# Altium project AC6901Demo_Project.PrjPcb
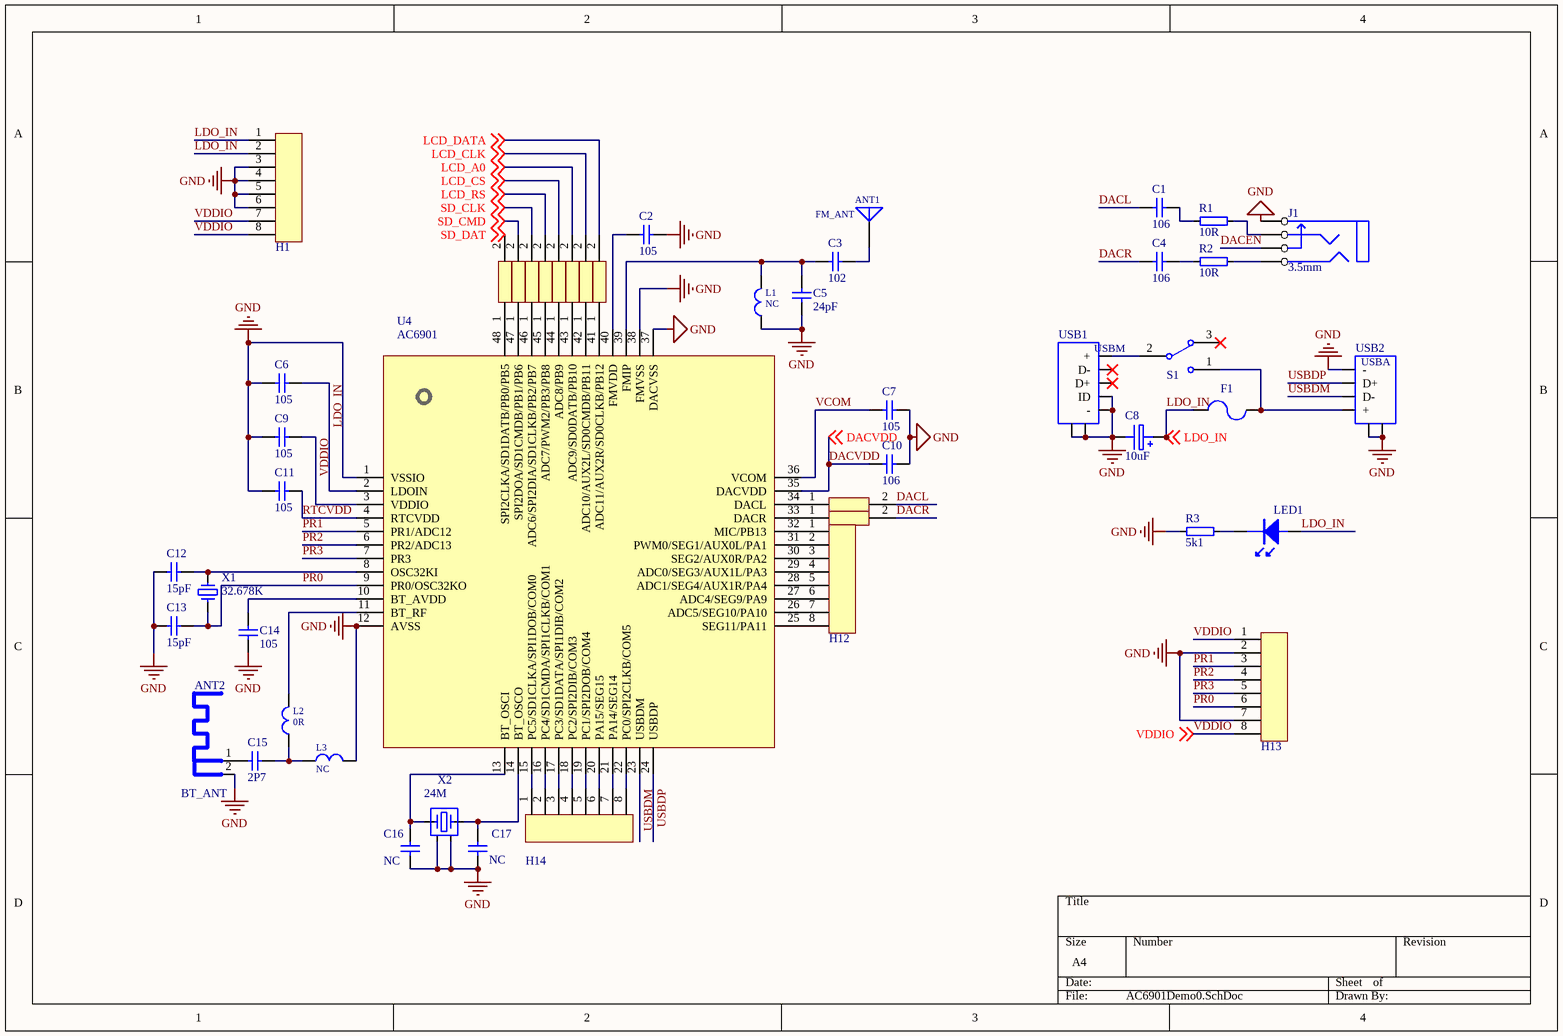
[diagram p0: AC6901Demo0.SchDoc]
2 sheets, 113 parts. Net scope: global (net labels, ports and power ports of the same name join across sheets).
Board file: PCB20230301.PcbDoc
Sheets:
  AC6901Demo0.SchDoc
  AC6901Demo1.SchDoc

## Sheet AC6901Demo0.SchDoc
size A4; SheetNumber: 1; SheetTotal: 2

### Parts
ANT1  FM_ANT  [FM_ANT]
ANT2  BT_ANT  [ANT-F-2-2.4G]
C1  106  [C 0805]
C2  105  [C 0805]
C3  102  [C 0805]
C4  106  [C 0805]
C5  24pF  [C 0805]
C6  105  [C 0805]
C7  105  [C 0805]
C8  10uF  [CTan(6032)]
C9  105  [C 0805]
C10  106  [C 0805]
C11  105  [C 0805]
C12  15pF  [C 0805]
C13  15pF  [C 0805]
C14  105  [C 0805]
C15  2P7  [C 0805]
C16  NC  [C 0805]
C17  NC  [C 0805]
F1  FUSE  [F1808]  (value not drawn)
H1  HDR1X8  [HDR1X8]  (value not drawn)
H2  HDR2X1  [HDR2X1]  (value not drawn)
H3  HDR2X1  [HDR2X1]  (value not drawn)
H4  HDR2X1  [HDR2X1]  (value not drawn)
H5  HDR2X1  [HDR2X1]  (value not drawn)
H6  HDR2X1  [HDR2X1]  (value not drawn)
H7  HDR2X1  [HDR2X1]  (value not drawn)
H8  HDR2X1  [HDR2X1]  (value not drawn)
H9  HDR2X1  [HDR2X1]  (value not drawn)
H10  HDR2X1  [HDR2X1]  (value not drawn)
H11  HDR2X1  [HDR2X1]  (value not drawn)
H12  HDR1X8  [HDR1X8]  (value not drawn)
H13  HDR1X8  [HDR1X8]  (value not drawn)
H14  HDR1X8  [HDR1X8]  (value not drawn)
J1  3.5mm  [AUX-3.5]
L1  NC  [L 0805]
L2  0R  [L 0805]
L3  NC  [L 0805]
LED1  LED  [LED 0805B]  (value not drawn)
R1  10R  [R 0805]
R2  10R  [R 0805]
R3  5k1  [R 0805]
S1  SW-SPDT  [MSK-12C01-07]  (value not drawn)
U4  AC6901  [LQPF48]
USB1  USBmirco  [USB_micro]  (value not drawn)
USB2  USBA  [USB-A]  (value not drawn)
X1  32.678K  [XTAL_3X8]
X2  24M  [XTAL_3225-4P]

### Nets
GND: ANT2.2 C2.1 C5.2 C6.2 C7.2 C8.2 C9.2 C10.2 C11.2 C12.1 C13.1 C14.1 C16.2 C17.1 H1.3 H1.4 H1.5 H1.6 H13.2 H13.7 J1.1 L1.1 L3.2 R3.1 U4.1(VSSIO) U4.12(AVSS) U4.37(DACVSS) U4.38(FMVSS) USB1.4(ID) USB1.5(-) USB1.GND USB2.4(-) USB2.5(GND) X2.2 X2.4
DACEN: J1.4
DACL: C1.1 H10.2
DACR: C4.1 H11.2
DACVDD: C10.1 U4.35(DACVDD) ; off-sheet DACVDD
LCD_A0: H7.2 ; off-sheet LCD_A0
LCD_CLK: H8.2 ; off-sheet LCD_CLK
LCD_CS: H6.2 ; off-sheet LCD_CS
LCD_DATA: H9.2 ; off-sheet LCD_DATA
LCD_RS: H5.2 ; off-sheet LCD_RS
LDO_IN: C6.1 C8.1 F1.1 H1.1 H1.2 LED1.1 U4.2(LDOIN) ; off-sheet LDO_IN
PR0: C13.2 H13.6 U4.9(PR0/OSC32KO) X1.2
PR1: H13.3 U4.5(PR1/ADC12)
PR2: H13.4 U4.6(PR2/ADC13)
PR3: H13.5 U4.7(PR3)
RTCVDD: C11.1 U4.4(RTCVDD)
SD_CLK: H4.2 ; off-sheet SD_CLK
SD_CMD: H3.2 ; off-sheet SD_CMD
SD_DAT: H2.2 ; off-sheet SD_DAT
USBDM: U4.23(USBDM) USB2.2(D-)
USBDP: U4.24(USBDP) USB2.3(D+)
VCOM: C7.1 U4.36(VCOM)
VDDIO: C9.1 H1.7 H1.8 H13.1 H13.8 U4.3(VDDIO) ; off-sheet VDDIO
NetANT1_1: ANT1.1 C3.2
NetANT2_1: ANT2.1 C15.1
NetC1_2: C1.2 R1.1
NetC2_2: C2.2 U4.40(FMVDD)
NetC3_1: C3.1 C5.1 L1.2 U4.39(FMIP)
NetC4_2: C4.2 R2.1
NetC12_2: C12.2 U4.8(OSC32KI) X1.1
NetC14_2: C14.2 U4.10(BT_AVDD)
NetC15_2: C15.2 L2.1 L3.1
NetC16_1: C16.1 U4.13(BT_OSCI) X2.3
NetC17_2: C17.2 U4.14(BT_OSCO) X2.1
NetF1_2: F1.2 S1.1 USB2.1(+)
NetH2_1: H2.1 U4.48(SPI2CLKA/SD1DATB/PB0/PB5)
NetH3_1: H3.1 U4.47(SPI2DOA/SD1CMDB/PB1/PB6)
NetH4_1: H4.1 U4.46(ADC6/SPI2DIA/SD1CLKB/PB2/PB7)
NetH5_1: H5.1 U4.45(ADC7/PWM2/PB3/PB8)
NetH6_1: H6.1 U4.44(ADC8/PB9)
NetH7_1: H7.1 U4.43(ADC9/SD0DATB/PB10)
NetH8_1: H8.1 U4.42(ADC10/AUX2L/SD0CMDB/PB11)
NetH9_1: H9.1 U4.41(ADC11/AUX2R/SD0CLKB/PB12)
NetH10_1: H10.1 U4.34(DACL)
NetH11_1: H11.1 U4.33(DACR)
NetH12_1: H12.1 U4.32(MIC/PB13)
NetH12_2: H12.2 U4.31(PWM0/SEG1/AUX0L/PA1)
NetH12_3: H12.3 U4.30(SEG2/AUX0R/PA2)
NetH12_4: H12.4 U4.29(ADC0/SEG3/AUX1L/PA3)
NetH12_5: H12.5 U4.28(ADC1/SEG4/AUX1R/PA4)
NetH12_6: H12.6 U4.27(ADC4/SEG9/PA9)
NetH12_7: H12.7 U4.26(ADC5/SEG10/PA10)
NetH12_8: H12.8 U4.25(SEG11/PA11)
NetH14_1: H14.1 U4.15(PC5/SD1CLKA/SPI1DOB/COM0)
NetH14_2: H14.2 U4.16(PC4/SD1CMDA/SPI1CLKB/COM1)
NetH14_3: H14.3 U4.17(PC3/SD1DATA/SPI1DIB/COM2)
NetH14_4: H14.4 U4.18(PC2/SPI2DIB/COM3)
NetH14_5: H14.5 U4.19(PC1/SPI2DOB/COM4)
NetH14_6: H14.6 U4.20(PA15/SEG15)
NetH14_7: H14.7 U4.21(PA14/SEG14)
NetH14_8: H14.8 U4.22(PC0/SPI2CLKB/COM5)
NetJ1_2: J1.2 R1.2
NetJ1_3: J1.3 R2.2
NetL2_2: L2.2 U4.11(BT_RF)
NetLED1_2: LED1.2 R3.2
NetS1_2: S1.2 USB1.1(+)

Not connected (* = marked no-connect by the designer): S1 3*; USB1 2(D-)* 3(D+)*

### Notes on the sheet
- (in symbol USBmirco) USBM

### Library data of the parts
C1-C7 C9-C17 = CAP-MLCC
C8 = CAP-ALE
J1 = 立体声插头
L1-L3 = INDUCTOR
R1-R3 = RES
X1 = XTAL_3X8
X2 = XTAL_3325-4
S1 = SW-SPDT: Published: 24-Mar-1999; LatestRevisionDate: 17-Dec-2003; LatestRevisionNote: Schematic revised, PCB Footprint replaced.; DatasheetDocument: 05-Dec-2000; PackageReference: TL36WW15050; Publisher: Altium Limited; ComponentLink1Description: Manufacturer Link; ComponentLink1URL: http://www.apem.com

## Sheet AC6901Demo1.SchDoc
size A4; SheetNumber: 2; SheetTotal: 2
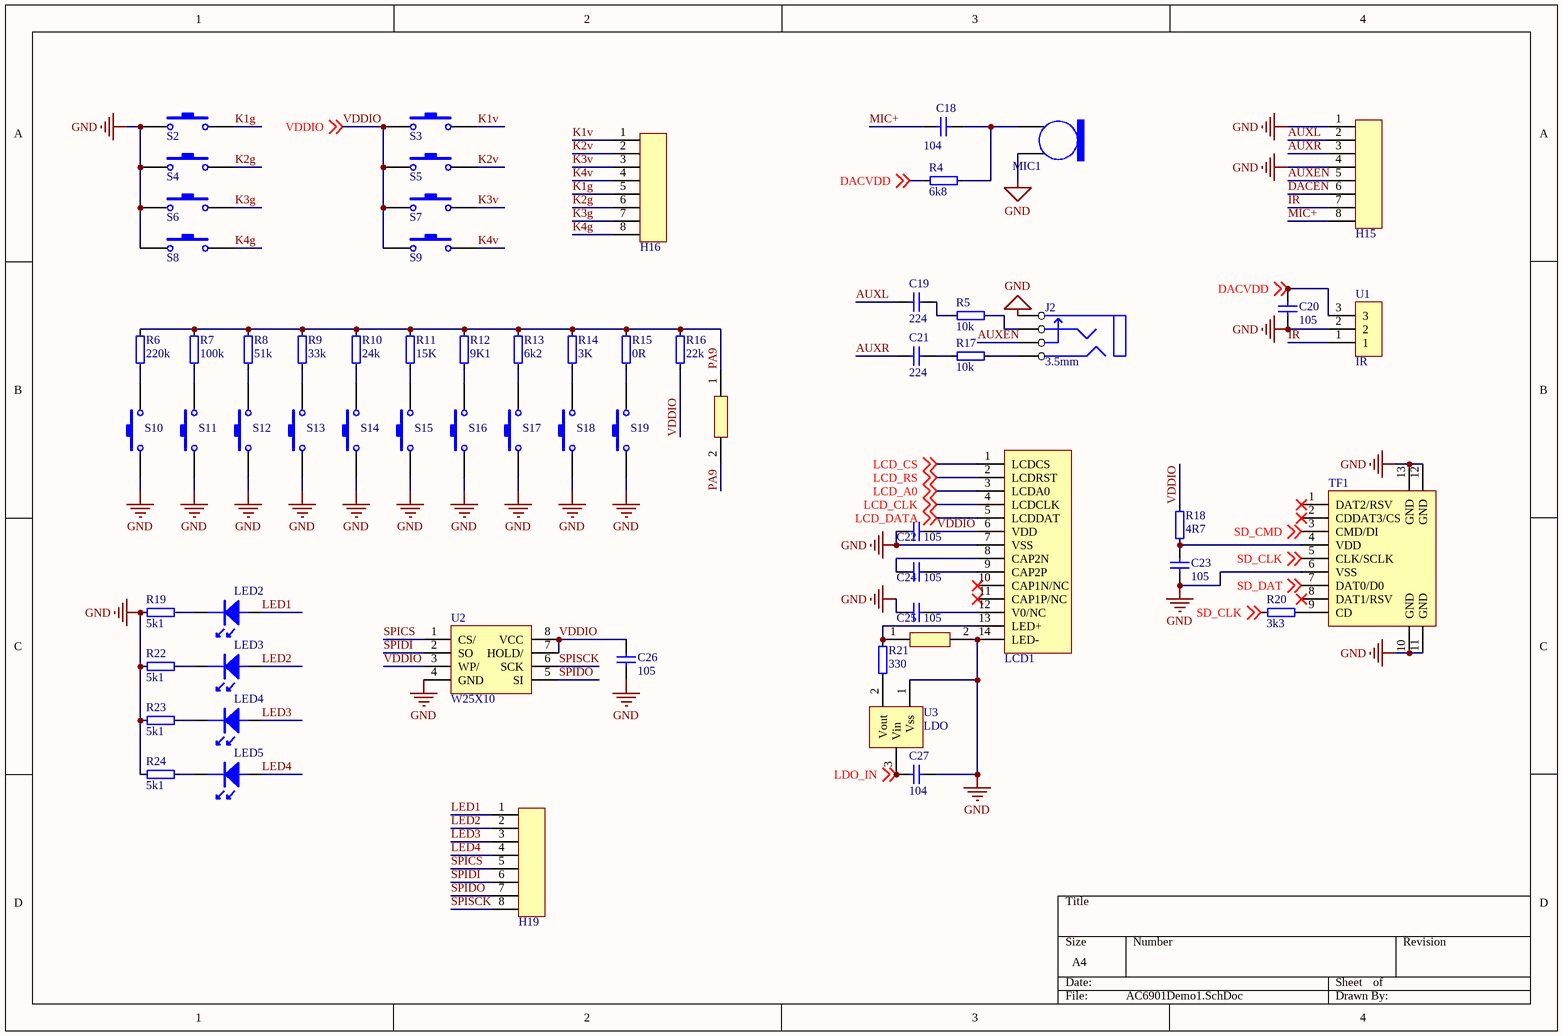
[diagram p1: AC6901Demo1.SchDoc]

### Parts
C18  104  [C 0805]
C19  224  [C 0805]
C20  105  [C 0805]
C21  224  [C 0805]
C22  105  [C 0805]
C23  105  [C 0805]
C24  105  [C 0805]
C25  105  [C 0805]
C26  105  [C 0805]
C27  104  [C 0805]
H15  HDR1X8  [HDR1X8]  (value not drawn)
H16  HDR1X8  [HDR1X8]  (value not drawn)
H17  HDR2X1  [HDR2X1]  (value not drawn)
H18  HDR2X1  [HDR2X1]  (value not drawn)
H19  HDR1X8  [HDR1X8]  (value not drawn)
J2  3.5mm  [AUX-3.5]
LCD1  LCD12864_ST7567  [FPC-SMD_P0.80-14P]  (value not drawn)
LED2  LED  [LED 0805B]  (value not drawn)
LED3  LED  [LED 0805B]  (value not drawn)
LED4  LED  [LED 0805B]  (value not drawn)
LED5  LED  [LED 0805B]  (value not drawn)
MIC1  MIC  [MIC]  (value not drawn)
R4  6k8  [R 0805]
R5  10k  [R 0805]
R6  220k  [R 0805]
R7  100k  [R 0805]
R8  51k  [R 0805]
R9  33k  [R 0805]
R10  24k  [R 0805]
R11  15K  [R 0805]
R12  9K1  [R 0805]
R13  6k2  [R 0805]
R14  3K  [R 0805]
R15  0R  [R 0805]
R16  22k  [R 0805]
R17  10k  [R 0805]
R18  4R7  [R 0805]
R19  5k1  [R 0805]
R20  3k3  [R 0805]
R21  330  [R 0805]
R22  5k1  [R 0805]
R23  5k1  [R 0805]
R24  5k1  [R 0805]
S2  SW-PB  [TSW SMD-3*6*2.5]  (value not drawn)
S3  SW-PB  [TSW SMD-3*6*2.5]  (value not drawn)
S4  SW-PB  [TSW SMD-3*6*2.5]  (value not drawn)
S5  SW-PB  [TSW SMD-3*6*2.5]  (value not drawn)
S6  SW-PB  [TSW SMD-3*6*2.5]  (value not drawn)
S7  SW-PB  [TSW SMD-3*6*2.5]  (value not drawn)
S8  SW-PB  [TSW SMD-3*6*2.5]  (value not drawn)
S9  SW-PB  [TSW SMD-3*6*2.5]  (value not drawn)
S10  SW-PB  [TSW SMD-3*6*2.5]  (value not drawn)
S11  SW-PB  [TSW SMD-3*6*2.5]  (value not drawn)
S12  SW-PB  [TSW SMD-3*6*2.5]  (value not drawn)
S13  SW-PB  [TSW SMD-3*6*2.5]  (value not drawn)
S14  SW-PB  [TSW SMD-3*6*2.5]  (value not drawn)
S15  SW-PB  [TSW SMD-3*6*2.5]  (value not drawn)
S16  SW-PB  [TSW SMD-3*6*2.5]  (value not drawn)
S17  SW-PB  [TSW SMD-3*6*2.5]  (value not drawn)
S18  SW-PB  [TSW SMD-3*6*2.5]  (value not drawn)
S19  SW-PB  [TSW SMD-3*6*2.5]  (value not drawn)
TF1  TF  [TF]  (value not drawn)
U1  IR  [IR]
U2  W25X10  [SOIC8]
U3  LDO  [SOT23-3L]

### Nets
GND: C20.1 C22.1 C23.1 C25.1 C26.1 C27.1 H15.1 H15.4 H18.2 J2.1 LCD1.7(VSS) LCD1.14(LED-) MIC1.2 R19.1 R22.1 R23.1 R24.1 S2.1 S4.1 S6.1 S8.1 S10.1 S11.1 S12.1 S13.1 S14.1 S15.1 S16.1 S17.1 S18.1 S19.1 TF1.6(VSS) TF1.10(GND) TF1.11(GND) TF1.12(GND) TF1.13(GND) U1.2 U2.4(GND) U3.1(Vss)
AUXEN: H15.5 J2.4
AUXL: C19.1 H15.2
AUXR: C21.1 H15.3
DACEN: H15.6
DACVDD: C20.2 R4.1 U1.3 ; off-sheet DACVDD
IR: H15.7 U1.1
K1g: H16.5 S2.2
K1v: H16.1 S3.2
K2g: H16.6 S4.2
K2v: H16.2 S5.2
K3g: H16.7 S6.2
K3v: H16.3 S7.2
K4g: H16.8 S8.2
K4v: H16.4 S9.2
LCD_A0: LCD1.3(LCDA0) ; off-sheet LCD_A0
LCD_CLK: LCD1.4(LCDCLK) ; off-sheet LCD_CLK
LCD_CS: LCD1.1(LCDCS) ; off-sheet LCD_CS
LCD_DATA: LCD1.5(LCDDAT) ; off-sheet LCD_DATA
LCD_RS: LCD1.2(LCDRST) ; off-sheet LCD_RS
LDO_IN: C27.2 U3.3(Vin) ; off-sheet LDO_IN
LED1: H19.1 LED2.1
LED2: H19.2 LED3.1
LED3: H19.3 LED4.1
LED4: H19.4 LED5.1
MIC+: C18.1 H15.8
PA9: H17.1 H17.2 R6.2 R7.2 R8.2 R9.2 R10.2 R11.2 R12.2 R13.2 R14.2 R15.2 R16.2
SD_CLK: R20.2 TF1.5(CLK/SCLK) ; off-sheet SD_CLK
SD_CMD: TF1.3(CMD/DI) ; off-sheet SD_CMD
SD_DAT: TF1.7(DAT0/D0) ; off-sheet SD_DAT
SPICS: H19.5 U2.1(CS/)
SPIDI: H19.6 U2.2(SO)
SPIDO: H19.7 U2.5(SI)
SPISCK: H19.8 U2.6(SCK)
VDDIO: C22.2 C26.2 LCD1.6(VDD) R16.1 R18.2 S3.1 S5.1 S7.1 S9.1 U2.3(WP/) U2.7(HOLD/) U2.8(VCC) ; off-sheet VDDIO
NetC18_2: C18.2 MIC1.1 R4.2
NetC19_2: C19.2 R5.1
NetC21_2: C21.2 R17.1
NetC23_2: C23.2 R18.1 TF1.4(VDD)
NetC24_1: C24.1 LCD1.8(CAP2N)
NetC24_2: C24.2 LCD1.9(CAP2P)
NetC25_2: C25.2 LCD1.12(V0/NC)
NetH18_1: H18.1 LCD1.13(LED+) R21.2
NetJ2_2: J2.2 R5.2
NetJ2_3: J2.3 R17.2
NetLED2_2: LED2.2 R19.2
NetLED3_2: LED3.2 R22.2
NetLED4_2: LED4.2 R23.2
NetLED5_2: LED5.2 R24.2
NetR6_1: R6.1 S10.2
NetR7_1: R7.1 S11.2
NetR8_1: R8.1 S12.2
NetR9_1: R9.1 S13.2
NetR10_1: R10.1 S14.2
NetR11_1: R11.1 S15.2
NetR12_1: R12.1 S16.2
NetR13_1: R13.1 S17.2
NetR14_1: R14.1 S18.2
NetR15_1: R15.1 S19.2
NetR20_1: R20.1 TF1.9(CD)
NetR21_1: R21.1 U3.2(Vout)

Not connected (* = marked no-connect by the designer): LCD1 10(CAP1N/NC)* 11(CAP1P/NC)*; TF1 1(DAT2/RSV)* 2(CDDAT3/CS)* 8(DAT1/RSV)*

### Library data of the parts
C18-C27 = CAP-MLCC
J2 = 立体声插头
R4-R24 = RES
S2-S19 = SW-PB: Published: 24-Mar-1999; LatestRevisionDate: 17-Jul-2002; LatestRevisionNote: Re-released for DXP Platform.; PackageReference: SPST-2; Publisher: Altium Limited

## Nets that join several sheets
GND: AC6901Demo0 (35 pins), AC6901Demo1 (39 pins)
DACEN: AC6901Demo0 (J1.4), AC6901Demo1 (H15.6)
DACVDD: AC6901Demo0 (C10.1 U4.35), AC6901Demo1 (C20.2 R4.1 U1.3)
LCD_A0: AC6901Demo0 (H7.2), AC6901Demo1 (LCD1.3)
LCD_CLK: AC6901Demo0 (H8.2), AC6901Demo1 (LCD1.4)
LCD_CS: AC6901Demo0 (H6.2), AC6901Demo1 (LCD1.1)
LCD_DATA: AC6901Demo0 (H9.2), AC6901Demo1 (LCD1.5)
LCD_RS: AC6901Demo0 (H5.2), AC6901Demo1 (LCD1.2)
LDO_IN: AC6901Demo0 (7 pins), AC6901Demo1 (C27.2 U3.3)
SD_CLK: AC6901Demo0 (H4.2), AC6901Demo1 (R20.2 TF1.5)
SD_CMD: AC6901Demo0 (H3.2), AC6901Demo1 (TF1.3)
SD_DAT: AC6901Demo0 (H2.2), AC6901Demo1 (TF1.7)
VDDIO: AC6901Demo0 (6 pins), AC6901Demo1 (12 pins)